# Altium project UNG8266_A.PrjPcb (part 5 of 5)

## Sheet Page 08-Strap&LEDs.SchDoc
size 416 x 264 mm; DrawnBy: Xuelu Li; Engineer: Parthiv/Xuelu; DocumentNumber: 8; Revision: A0; SheetNumber: 8; SheetTotal: 8; PageSetup: Record=PageOptions|CenterHorizontal=True|CenterVertical=True|PrintScale=1.02|XCorrection=1.00|YCorrection=1.00|PrintKind=0|BorderSize=5000000|LeftOffset=0|BottomOffset=0|Orientation=2|PaperLength=1000|PaperWidth=1000|Scale=100|PaperSource=15|PrintQuality=600|MediaType=1|DitherType=10|PrintScaleMode=1|PaperKind=11x17|PaperIndex=17; PageTitle: LEDs & Strapping; ProjName: EVB-LAN9254-DIGIO; DesignDescription: LAN9254 Evaluation Board; Designer: Xuelu Li; PartNumber: EVB-LAN9254-DIGIO; Sheet1Title: LEDs & Strapping; DocumentFullPathAndName: //depot_np_hweng_boards/ung_hweng/UNG_8017_EVB-USB5926/; ProjectName: UNG8266_A.PrjPcb
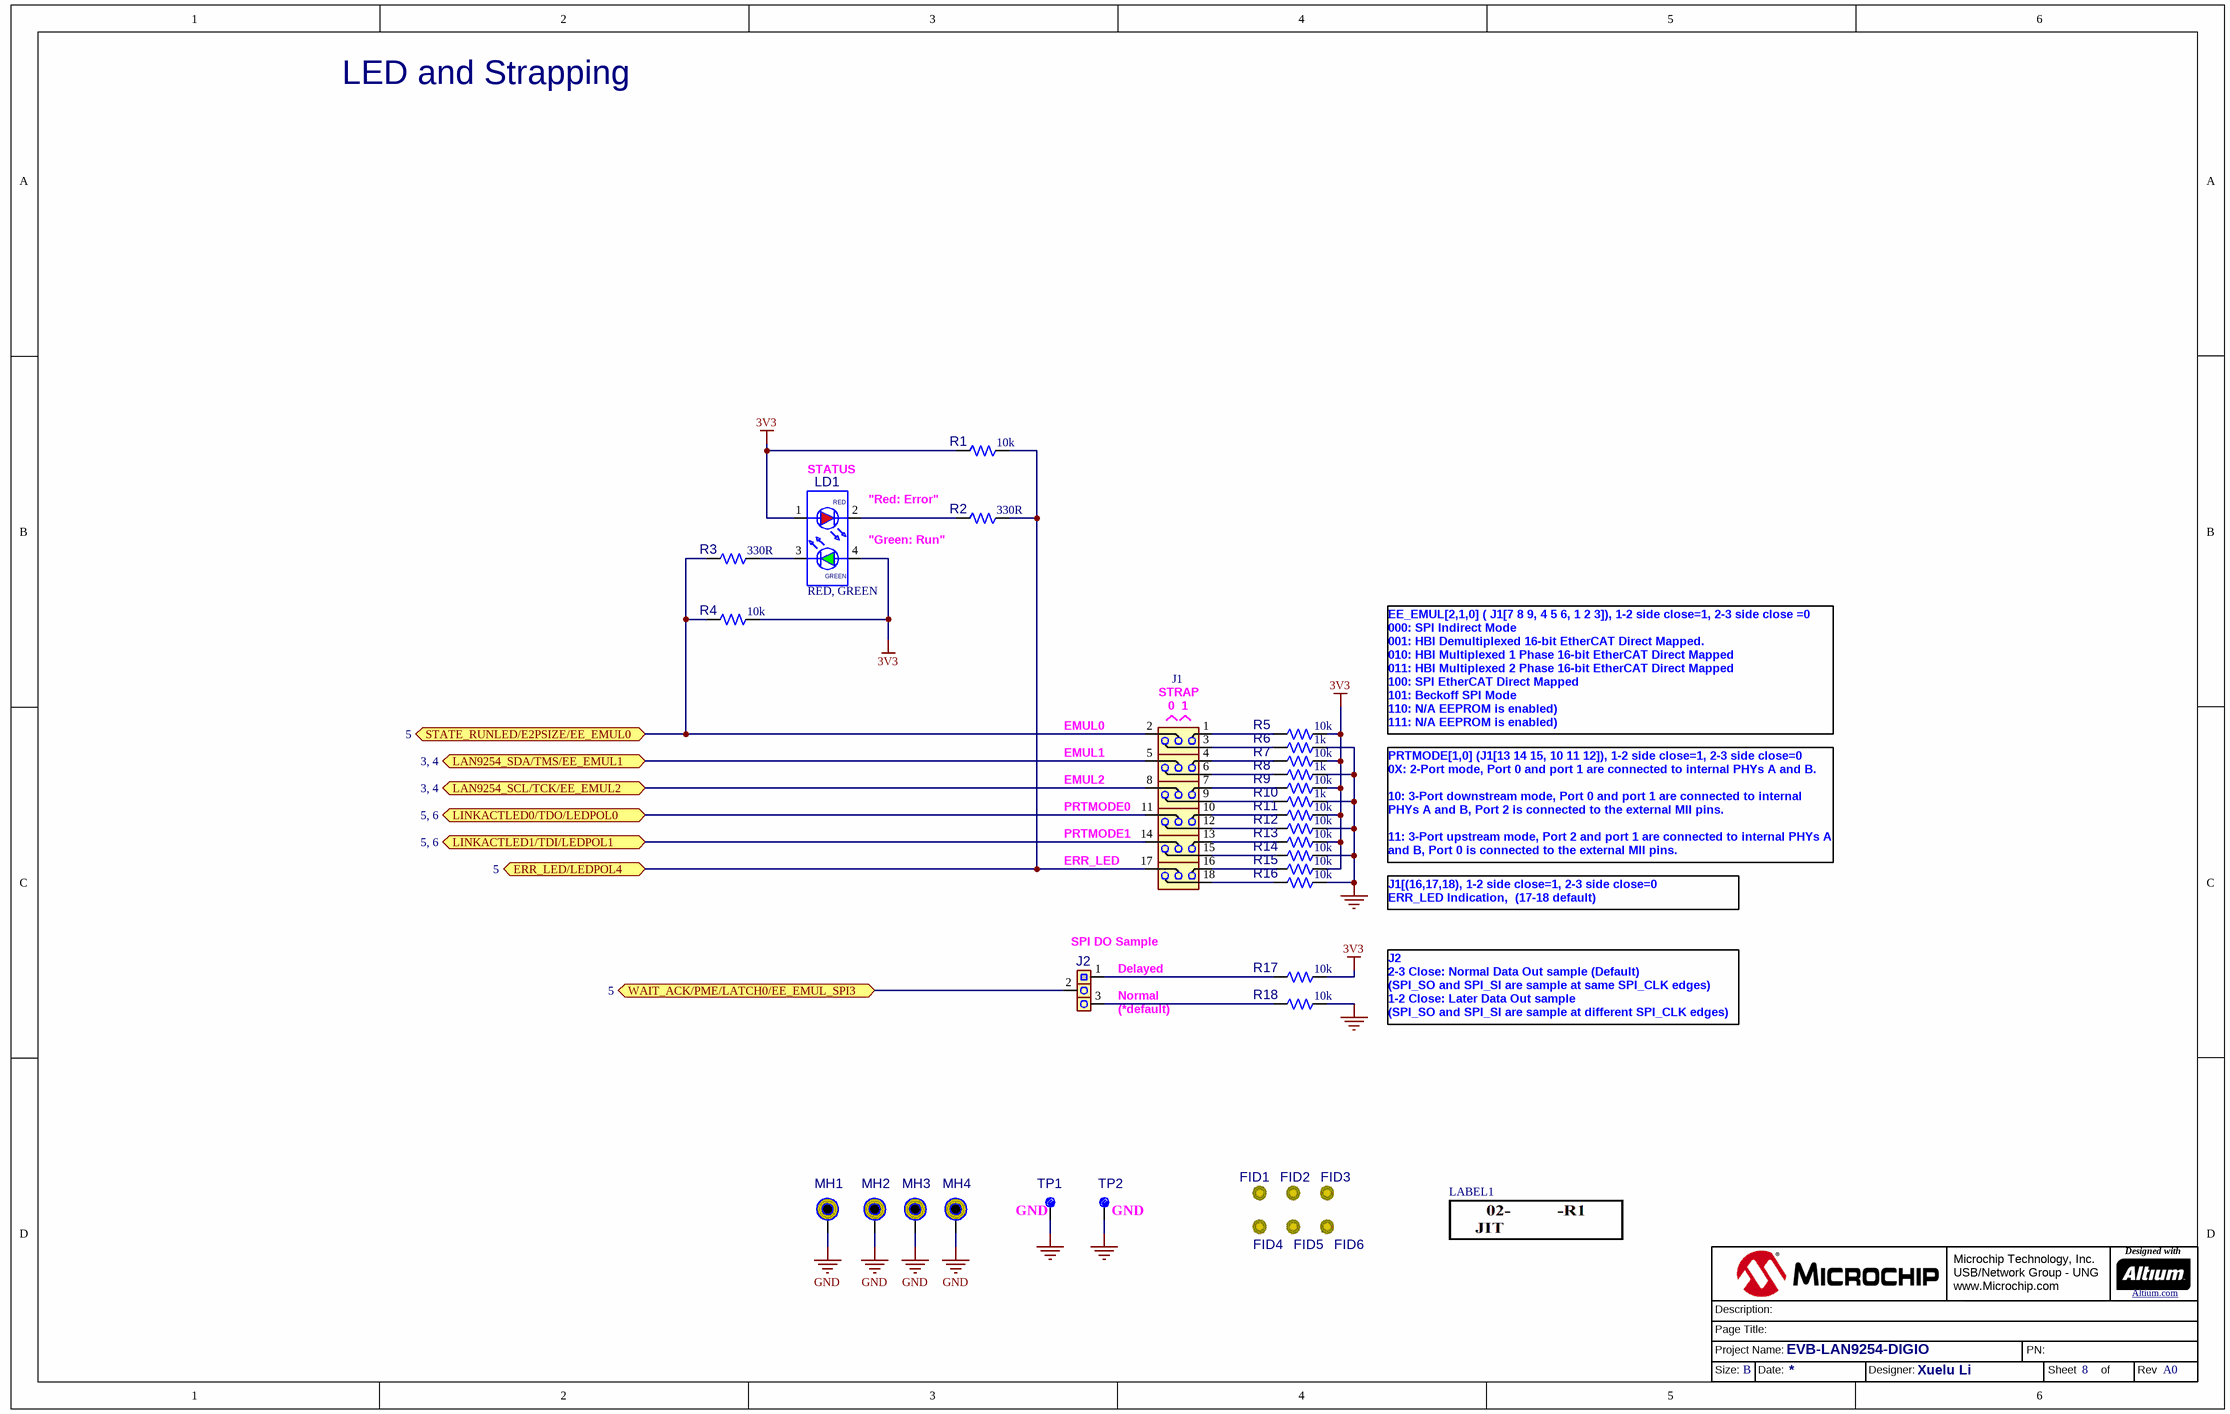
[diagram p7: Page 08-Strap&LEDs.SchDoc]

### Parts
(Parts that share a designator on the sheet are numbered #1, #2 ... from top to bottom, then left to right.)
?#8  (no value)  (graphical)
FID1  FIDUCIAL  [FIDUCIAL]  (value not drawn)  (no BOM)
FID2  FIDUCIAL  [FIDUCIAL]  (value not drawn)  (no BOM)
FID3  FIDUCIAL  [FIDUCIAL]  (value not drawn)  (no BOM)
FID4  FIDUCIAL  [FIDUCIAL]  (value not drawn)  (no BOM)
FID5  FIDUCIAL  [FIDUCIAL]  (value not drawn)  (no BOM)
FID6  FIDUCIAL  [FIDUCIAL]  (value not drawn)  (no BOM)
J1  Header 3X6  [HDR_M_2.54_3X6]  (value not drawn)
J2  Header 1x3  [HDR_M_2.54_1x3]  (value not drawn)
LABEL1  LABEL_Need_Help_Small  [LABEL_Need_Help_Small]  (value not drawn)
LD1  value RED, GREEN  [LED_DUAL_SMD_2x1.25mm]  (hidden comment: LED DUAL 4 pin)
MH1  MTHOLE 4-40 120DL 220PAD  [MTHOLE_4-40]  (value not drawn)  (no BOM)
MH2  MTHOLE 4-40 120DL 220PAD  [MTHOLE_4-40]  (value not drawn)  (no BOM)
MH3  MTHOLE 4-40 120DL 220PAD  [MTHOLE_4-40]  (value not drawn)  (no BOM)
MH4  MTHOLE 4-40 120DL 220PAD  [MTHOLE_4-40]  (value not drawn)  (no BOM)
R1  value 10k  [RES_C_0603]  (hidden comment: Resistor)
R2  value 330R  [RES_C_0603]  (hidden comment: Resistor)
R3  value 330R  [RES_C_0603]  (hidden comment: Resistor)
R4  value 10k  [RES_C_0603]  (hidden comment: Resistor)
R5  value 10k  [RES_C_0603]  (hidden comment: Resistor)
R6  value 1k  [RES_C_0603]  (hidden comment: Resistor)
R7  value 10k  [RES_C_0603]  (hidden comment: Resistor)
R8  value 1k  [RES_C_0603]  (hidden comment: Resistor)
R9  value 10k  [RES_C_0603]  (hidden comment: Resistor)
R10  value 1k  [RES_C_0603]  (hidden comment: Resistor)
R11  value 10k  [RES_C_0603]  (hidden comment: Resistor)
R12  value 10k  [RES_C_0603]  (hidden comment: Resistor)
R13  value 10k  [RES_C_0603]  (hidden comment: Resistor)
R14  value 10k  [RES_C_0603]  (hidden comment: Resistor)
R15  value 10k  [RES_C_0603]  (hidden comment: Resistor)
R16  value 10k  [RES_C_0603]  (hidden comment: Resistor)
R17  value 10k  [RES_C_0603]  (hidden comment: Resistor)
R18  value 10k  [RES_C_0603]  (hidden comment: Resistor)
TP1  Test Point  [CON_TP_TH_V_BLK_KEC_5001]  (value not drawn)
TP2  Test Point  [CON_TP_TH_V_BLK_KEC_5001]  (value not drawn)

### Ports
ERR_LED/LEDPOL4 (bidir, see 5), LAN9254_SCL/TCK/EE_EMUL2 (bidir, see 3, 4), LAN9254_SDA/TMS/EE_EMUL1 (bidir, see 3, 4), LINKACTLED0/TDO/LEDPOL0 (bidir, see 5, 6), LINKACTLED1/TDI/LEDPOL1 (bidir, see 5, 6), STATE_RUNLED/E2PSIZE/EE_EMUL0 (bidir, see 5), WAIT_ACK/PME/LATCH0/EE_EMUL_SPI3 (bidir, see 5)

### Nets
3V3: LD1.1(A1) LD1.4(A2) R1.1 R4.2 R5.1 R7.1 R9.1 R11.1 R13.1 R15.1 R17.1
GND: MH1.1 MH2.1 MH3.1 MH4.1 R6.2 R8.2 R10.2 R12.1 R14.1 R16.1 R18.1 TP1.1 TP2.1
ERR_LED/LEDPOL4: J1.17 R1.2 R2.2 ; port ERR_LED/LEDPOL4
LAN9254_SCL/TCK/EE_EMUL2: J1.8 ; port LAN9254_SCL/TCK/EE_EMUL2
LAN9254_SDA/TMS/EE_EMUL1: J1.5 ; port LAN9254_SDA/TMS/EE_EMUL1
LINKACTLED0/TDO/LEDPOL0: J1.11 ; port LINKACTLED0/TDO/LEDPOL0
LINKACTLED1/TDI/LEDPOL1: J1.14 ; port LINKACTLED1/TDI/LEDPOL1
STATE_RUNLED/E2PSIZE/EE_EMUL0: J1.2 R3.1 R4.1 ; port STATE_RUNLED/E2PSIZE/EE_EMUL0
WAIT_ACK/PME/LATCH0/EE_EMUL_SPI3: J2.2 ; port WAIT_ACK/PME/LATCH0/EE_EMUL_SPI3
NetJ1_1: J1.1 R5.2
NetJ1_3: J1.3 R6.1
NetJ1_4: J1.4 R7.2
NetJ1_6: J1.6 R8.1
NetJ1_7: J1.7 R9.2
NetJ1_9: J1.9 R10.1
NetJ1_10: J1.10 R11.2
NetJ1_12: J1.12 R12.2
NetJ1_13: J1.13 R13.2
NetJ1_15: J1.15 R14.2
NetJ1_16: J1.16 R15.2
NetJ1_18: J1.18 R16.2
NetJ2_1: J2.1 R17.2
NetJ2_3: J2.3 R18.2
NetLD1_2: LD1.2(K1) R2.1
NetLD1_3: LD1.3(K2) R3.2

### Notes on the sheet
- LED and Strapping
- (near LD1) STATUS
- "Red: Error"
- "Green: Run"
- EMUL0
- EMUL1
- (near J1) STRAP
- (near J1) 0
- (near J1) 1
- EE_EMUL[2,1,0] ( J1[7 8 9, 4 5 6, 1 2 3]), 1-2 side close=1, 2-3 side close =0
  000: SPI Indirect Mode
  001: HBI Demultiplexed 16-bit EtherCAT Direct Mapped.
  010: HBI Multiplexed 1 Phase 16-bit EtherCAT Direct Mapped
  011: HBI Multiplexed 2 Phase 16-bit EtherCAT Direct Mapped
  100: SPI EtherCAT Direct Mapped
  101: Beckoff SPI Mode
  110: N/A EEPROM is enabled)
  111: N/A EEPROM is enabled)
- EMUL2
- (near J1) PRTMODE0
- (near J1) ERR_LED
- (near J1) PRTMODE1
- PRTMODE[1,0] (J1[13 14 15, 10 11 12]), 1-2 side close=1, 2-3 side close=0
  0X: 2-Port mode, Port 0 and port 1 are connected to internal PHYs A and B.
  10: 3-Port downstream mode, Port 0 and port 1 are connected to internal PHYs A and B, Port 2 is connected to the external MII pins.
  11: 3-Port upstream mode, Port 2 and port 1 are connected to internal PHYs A and B, Port 0 is connected to the external MII pins.
- (near J2) SPI DO Sample
- J1[(16,17,18), 1-2 side close=1, 2-3 side close=0
  ERR_LED Indication,  (17-18 default)
- (near J2) Delayed
- (near J2) Normal
- (near J2) (*default)
- J2
  2-3 Close: Normal Data Out sample (Default)
  (SPI_SO and SPI_SI are sample at same SPI_CLK edges)
  1-2 Close: Later Data Out sample
  (SPI_SO and SPI_SI are sample at different SPI_CLK edges)
- (near TP1) GND
- (near TP2) GND
- Microchip Technology, Inc.
  USB/Network Group - UNG
  www.Microchip.com
- Designed with
- Altium.com <http://go.altium.com/MicrochipLandingPage_Evaluation.html>
- Page Title:
- Project Name:
- Description:
- PN:
- Size:
- B
- Date:
- Designer:
- Sheet
- of
- Rev
- (in symbol DIODE1110) RED; GREEN

### Library data of the parts
?#8 = Title Block B_UNG1_Altium
FID1-FID6 = FIDUCIAL: Populated: DNP; Revision: 0; Description_: FIDUCIAL
J1 = MIC8078: Manufacturer 1: Digikey; Manufacturer Part Number 1: TSW-106-07-G-T; Value: HDR_M_2.54_3X6; Dev Tools Status: Design; Owner: Manikandan Balakrishnan; Populated: YES; MCHP-ID: MIC8078; Revision: A; Symbol: header 3x6; Description_: Header 3X6; Status: MCL Design; ComponentLink1URL: https://chn-vm-apps.microchip.com/mchprepo/parts/Datasheets/tsw-xxx-xx-xxx-x-xx-xxx-mkt; ComponentLink1Description: SVN Datasheet; ComponentLink2URL: C:\ALTIUM_WORK\00001_MCHP-CDB\Datasheets\tsw-xxx-xx-xxx-x-xx-xxx-mkt; ComponentLink2Description: Local Datasheet; ComponentLink3URL: C:\ALTIUM_WORK\00001_MCHP-CDB\Library\LibraryRefs\header 3x6.SchLib; ComponentLink3Description: Open Symbol; ComponentLink4URL: C:\ALTIUM_WORK\00001_MCHP-CDB\Library\Footprints\HDR_M_2.54_3X6.PcbLib; ComponentLink4Description: Open Footprint; ComponentLink5Description: Open Footprint 2; ComponentLink6Description: Open Footprint 3; ComponentLink7Description: Open Footprint 4; Type: Header 2.54mm; Category: Connector; Supplier 1: Digikey; Supplier Part Number 1: TSW-106-07-G-T-ND; Quantity Override: 1
J2 = CON0465: Manufacturer 1: Samtec; Manufacturer Part Number 1: TSW-103-07-T-S; Value: HDR-2.54 Male 1x3; Description_: CON HDR-2.54 Male 1x3 Tin 5.84MH TH VERT; Dev Tools Status: Production; Populated: Yes; MCHP-ID: CON0465; Revision: 1; Symbol: Header 1x3; Status: MCL Design; ComponentLink1URL: https://chn-vm-apps.microchip.com/mchprepo/parts/Datasheets/TSW-XXX-XX-XXX-X-XX-XXX-MKT.pdf; ComponentLink1Description: SVN Datasheet; ComponentLink2URL: C:\ALTIUM_WORK\00001_MCHP-CDB\Datasheets\TSW-XXX-XX-XXX-X-XX-XXX-MKT.pdf; ComponentLink2Description: Local Datasheet; ComponentLink3URL: C:\ALTIUM_WORK\00001_MCHP-CDB\Library\LibraryRefs\Header 1x3.SchLib; ComponentLink3Description: Open Symbol; ComponentLink4URL: C:\ALTIUM_WORK\00001_MCHP-CDB\Library\Footprints\HDR_M_2.54_1x3.PcbLib; ComponentLink4Description: Open Footprint; ComponentLink5Description: Open Footprint 2; ComponentLink6Description: Open Footprint 3; ComponentLink7Description: Open Footprint 4; Type: Header 2.54mm; Category: Connector; Manufacturer 2: SHENZHEN JUNHAO ENGINEERING; Manufacturer Part Number 2: R-211-0311-0021-000; Supplier 1: Digi-Key; Supplier Part Number 1: SAM1035-03-ND; Supplier 2: Raynen; Supplier Part Number 2: CONN00253B01; Quantity Override: 1
LABEL1 = 08-00028: Value: LABEL Need Help Small; Description_: LABEL, ASSY W/REV LEVEL (SMALL MODULES) PER MTS-0002; Dev Tools Status: Production; Populated: MECH; MCHP-ID: 08-00028; Revision: 6; Symbol: LABEL_Need_Help_Small; Status: MCL Design; ComponentLink1URL: https://chn-vm-apps.microchip.com/mchprepo/parts/Datasheets/08-00028R6.pdf; ComponentLink1Description: SVN Datasheet; ComponentLink2URL: C:\ALTIUM_WORK\00001_MCHP-CDB\Datasheets\08-00028R6.pdf; ComponentLink2Description: Local Datasheet; ComponentLink3URL: C:\ALTIUM_WORK\00001_MCHP-CDB\Library\LibraryRefs\LABEL_Need_Help_Small.SchLib; ComponentLink3Description: Open Symbol; ComponentLink4URL: C:\ALTIUM_WORK\00001_MCHP-CDB\Library\Footprints\LABEL_Need_Help_Small.PcbLib; ComponentLink4Description: Open Footprint; ComponentLink5Description: Open Footprint 2; ComponentLink6Description: Open Footprint 3; ComponentLink7Description: Open Footprint 4; Type: Small; Category: Label; Quantity Override: 1
LD1 = DIODE1110: LED; Manufacturer 1: Kingbright Corp; Manufacturer Part Number 1: APHBM2012SURKCGKC; Description_: DIO LED BI RED, GREEN 1.95V, 2.1V 30mA 0805; Dev Tools Status: Production; Type: LED Bicolor; Forward Current: 30mA; Power: 75mW; Reverse Current: 10uA; Owner: Bogdan P (M91398); Populated: Yes; MCHP-ID: DIODE1110; Revision: 0; Symbol: LED DUAL 4 PIN; Status: MCL Design; Package: 0805; ComponentLink1URL: https://chn-vm-apps.microchip.com/mchprepo/parts/Datasheets/APHBM2012SURKCGKC.pdf; ComponentLink1Description: SVN Datasheet; ComponentLink2URL: C:\ALTIUM_WORK\00001_MCHP-CDB\Datasheets\APHBM2012SURKCGKC.pdf; ComponentLink2Description: Local Datasheet; ComponentLink3URL: C:\ALTIUM_WORK\00001_MCHP-CDB\Library\LibraryRefs\LED DUAL 4 PIN.SchLib; ComponentLink3Description: Open Symbol; ComponentLink4URL: C:\ALTIUM_WORK\00001_MCHP-CDB\Library\Footprints\LED_DUAL_SMD_2x1.25mm.PcbLib; ComponentLink4Description: Open Footprint; ComponentLink5Description: Open Footprint 2; ComponentLink6Description: Open Footprint 3; ComponentLink7Description: Open Footprint 4; Operating Temperature: -40C to +85C; Category: Diode; Supplier 1: Digi-Key; Supplier Part Number 1: 754-1093-1-ND; Quantity Override: 1
MH1-MH4 = MTHOLE 4-40 120DL 220PAD: Populated: DNP; Revision: 0; Description_: MTHOLE 4-40 120DL 220PAD
R1 R4 R5 R7 R9 R11-R18 = RSMT0139: Manufacturer 1: Panasonic; Manufacturer Part Number 1: ERJ-3EKF1002V; Tolerance: 1%; Description_: RES TKF 10k 1% 1/10W SMD 0603; Dev Tools Status: Production; Temperature Coeffcient: 100ppm/C; Power: 1/10W; Populated: Yes; MCHP-ID: RSMT0139; Package: 0603; Revision: 2; Symbol: Resistor; Status: MCL Design; ComponentLink1URL: https://chn-vm-apps.microchip.com/mchprepo/parts/Datasheets/nrc.pdf; ComponentLink1Description: SVN Datasheet; ComponentLink2URL: C:\ALTIUM_WORK\00001_MCHP-CDB\Datasheets\nrc.pdf; ComponentLink2Description: Local Datasheet; ComponentLink3URL: C:\ALTIUM_WORK\00001_MCHP-CDB\Library\LibraryRefs\Resistor.SchLib; ComponentLink3Description: Open Symbol; ComponentLink4URL: C:\ALTIUM_WORK\00001_MCHP-CDB\Library\Footprints\RES_C_0603.PcbLib; ComponentLink4Description: Open Footprint; ComponentLink5Description: Open Footprint 2; ComponentLink6Description: Open Footprint 3; ComponentLink7Description: Open Footprint 4; Operating Temperature: -55C to +155C; Category: Resistor; Type: RES SMD; Composition: TKF; Manufacturer 2: Stackpole Electronics Inc; Manufacturer Part Number 2: RMCF0603FT10K0; Manufacturer 3: Yageo; Manufacturer Part Number 3: RC0603FR-0710KL; Manufacturer 4: Stackpole Electronics Inc; Manufacturer Part Number 4: RMCF 1/16 10K 1% R; Manufacturer 5: Xicon; Manufacturer Part Number 5: 302-10K-RC; Manufacturer 6: NIC Components; Manufacturer Part Number 6: NRC06F1002TRF; Supplier 1: Digi-Key; Supplier Part Number 1: P10.0KHCT-ND; Supplier 2: Digi-Key; Supplier Part Number 2: RMCF1/1610KFRTR-ND; Supplier 3: Digi-Key; Supplier Part Number 3: 311-10.0KHRCT-ND; Supplier 4: Digi-Key; Supplier Part Number 4: RMCF0603FT10K0TR-ND; Supplier 5: Mouser; Supplier Part Number 5: 302-10k-RC; Supplier 6: NIC Components; Supplier Part Number 6: NRC06F1002TRF; Quantity Override: 1
R2 R3 = RES0195: Manufacturer 1: ROHM; Manufacturer Part Number 1: MCR03EZPJ331; Tolerance: 5%; Description_: RES TKF 330R 5% 1/10W SMD 0603; Dev Tools Status: Production; Voltage: 50V; Temperature Coeffcient: 100ppm/C; Power: 1/10W; Populated: Yes; MCHP-ID: RES0195; Package: 0603; Revision: 1; Symbol: Resistor; Status: MCL Design; ComponentLink1URL: https://chn-vm-apps.microchip.com/mchprepo/parts/Datasheets/mcr_a.pdf; ComponentLink1Description: SVN Datasheet; ComponentLink2URL: C:\ALTIUM_WORK\00001_MCHP-CDB\Datasheets\mcr_a.pdf; ComponentLink2Description: Local Datasheet; ComponentLink3URL: C:\ALTIUM_WORK\00001_MCHP-CDB\Library\LibraryRefs\Resistor.SchLib; ComponentLink3Description: Open Symbol; ComponentLink4URL: C:\ALTIUM_WORK\00001_MCHP-CDB\Library\Footprints\RES_C_0603.PcbLib; ComponentLink4Description: Open Footprint; ComponentLink5Description: Open Footprint 2; ComponentLink6Description: Open Footprint 3; ComponentLink7Description: Open Footprint 4; Operating Temperature: -55C to +155C; Category: Resistor; Type: RES SMD; Composition: TKF; Manufacturer 2: Stackpole Electronics Inc; Manufacturer Part Number 2: RMCF0603JT330R; Manufacturer 3: Yageo; Manufacturer Part Number 3: 9C06031A3300JLHFT; Supplier 1: Digi-Key; Supplier Part Number 1: RHM330GCT-ND; Supplier 2: Digi-Key; Supplier Part Number 2: RMCF0603JT330RCT-ND; Supplier 3: Digi-Key; Supplier Part Number 3: 311-330GDKR-ND; Quantity Override: 1
R6 R8 R10 = RES1128: Manufacturer 1: Panasonic; Manufacturer Part Number 1: ERJ-3GEYJ102V; Tolerance: 5%; Description_: RES TKF 1k 5% 1/10W SMD 0603; Dev Tools Status: Production; Voltage: 75V; Temperature Coeffcient: 200ppm/C; Power: 1/10W; Owner: Bogdan P (M91398); Populated: Yes; MCHP-ID: RES1128; Package: 0603; Revision: 0; Symbol: Resistor; Status: MCL Design; ComponentLink1URL: https://chn-vm-apps.microchip.com/mchprepo/parts/Datasheets/AOA0000CE1.pdf; ComponentLink1Description: SVN Datasheet; ComponentLink2URL: C:\ALTIUM_WORK\00001_MCHP-CDB\Datasheets\AOA0000CE1.pdf; ComponentLink2Description: Local Datasheet; ComponentLink3URL: C:\ALTIUM_WORK\00001_MCHP-CDB\Library\LibraryRefs\Resistor.SchLib; ComponentLink3Description: Open Symbol; ComponentLink4URL: C:\ALTIUM_WORK\00001_MCHP-CDB\Library\Footprints\RES_C_0603.PcbLib; ComponentLink4Description: Open Footprint; ComponentLink5Description: Open Footprint 2; ComponentLink6Description: Open Footprint 3; ComponentLink7Description: Open Footprint 4; Operating Temperature: -55C to +155C; Category: Resistor; Type: RES SMD; Composition: TKF; Supplier 1: Digi-Key; Supplier Part Number 1: P1.0KGCT-ND; Quantity Override: 1
TP1 TP2 = MISC0026: Manufacturer 1: Keystone; Manufacturer Part Number 1: 5001; Value: TP LOOP Black; Description_: MISC, TEST POINT MULTI PURPOSE MINI BLACK; Dev Tools Status: Production; Owner: Stephen Humberd; Populated: YES; MCHP-ID: MISC0026; Revision: 0; Symbol: Test Point; Status: MCL Design; ComponentLink1URL: https://chn-vm-apps.microchip.com/mchprepo/parts/Datasheets/5000-5004.PDF; ComponentLink1Description: SVN Datasheet; ComponentLink2URL: C:\ALTIUM_WORK\00001_MCHP-CDB\Datasheets\5000-5004.PDF; ComponentLink2Description: Local Datasheet; ComponentLink3URL: C:\ALTIUM_WORK\00001_MCHP-CDB\Library\LibraryRefs\Test Point.SchLib; ComponentLink3Description: Open Symbol; ComponentLink4URL: C:\ALTIUM_WORK\00001_MCHP-CDB\Library\Footprints\CON_TP_TH_V_BLK_KEC_5001.PcbLib; ComponentLink4Description: Open Footprint; ComponentLink5Description: Open Footprint 2; ComponentLink6Description: Open Footprint 3; ComponentLink7Description: Open Footprint 4; Type: Test Point; Category: Connector; Supplier 1: Digi-Key; Supplier Part Number 1: 36-5001-ND; Quantity Override: 1

## Nets that join several sheets
3V3: PAGE 03-Power&I2C (27 pins), Page 04-LAN9254-Part1 (25 pins), Page 05-LAN9254-Part2 (5 pins), PAGE 06-Copper Ports (R110.1 R117.1), PAGE 07-DIGITAL IO (32 pins), Page 08-Strap&LEDs (11 pins)
5-12V: PAGE 03-Power&I2C (6 pins), Page 05-LAN9254-Part2 (J8.3)
GND: PAGE 03-Power&I2C (30 pins), Page 04-LAN9254-Part1 (44 pins), Page 05-LAN9254-Part2 (32 pins), PAGE 06-Copper Ports (14 pins), PAGE 07-DIGITAL IO (36 pins), Page 08-Strap&LEDs (13 pins)
VDD33TXRX1: Page 04-LAN9254-Part1 (C8.1 C9.2 FB2.2 U4.67), PAGE 06-Copper Ports (5 pins)
VDD33TXRX2: Page 04-LAN9254-Part1 (C23.2 C24.1 FB4.2 U4.80), PAGE 06-Copper Ports (5 pins)
DIGIO0: Page 05-LAN9254-Part2 (R61.1 R72.1 U4.49 U5.2), PAGE 07-DIGITAL IO (J22.2)
DIGIO1: Page 05-LAN9254-Part2 (R68.1 R73.1 U4.52 U5.3), PAGE 07-DIGITAL IO (J22.5)
DIGIO2: Page 05-LAN9254-Part2 (R70.1 R74.1 U4.53 U5.4), PAGE 07-DIGITAL IO (J22.8)
DIGIO3: Page 05-LAN9254-Part2 (R75.1 U4.62 U5.5), PAGE 07-DIGITAL IO (J22.11)
DIGIO4: Page 05-LAN9254-Part2 (R59.1 R76.1 U4.30 U5.6), PAGE 07-DIGITAL IO (J22.14)
DIGIO5: Page 05-LAN9254-Part2 (R58.1 R77.1 U4.29 U5.7), PAGE 07-DIGITAL IO (J22.17)
DIGIO6: Page 05-LAN9254-Part2 (R55.1 R78.1 U4.28 U5.8), PAGE 07-DIGITAL IO (J22.20)
DIGIO7: Page 05-LAN9254-Part2 (R54.1 R79.1 U4.20 U5.9), PAGE 07-DIGITAL IO (J22.23)
DIGIO8: Page 05-LAN9254-Part2 (R53.1 R80.1 U4.19 U6.2), PAGE 07-DIGITAL IO (J23.2)
DIGIO9: Page 05-LAN9254-Part2 (R60.1 R81.1 U4.41 U6.3), PAGE 07-DIGITAL IO (J23.5)
DIGIO10: Page 05-LAN9254-Part2 (R82.1 U4.36 U6.4), PAGE 07-DIGITAL IO (J23.8)
DIGIO11: Page 05-LAN9254-Part2 (R62.1 R83.1 U4.33 U6.5), PAGE 07-DIGITAL IO (J23.11)
DIGIO12: Page 05-LAN9254-Part2 (R63.1 R84.1 U4.34 U6.6), PAGE 07-DIGITAL IO (J23.14)
DIGIO13: Page 05-LAN9254-Part2 (R65.1 R85.1 U4.35 U6.7), PAGE 07-DIGITAL IO (J23.17)
DIGIO14: Page 05-LAN9254-Part2 (R66.1 R86.1 U4.37 U6.8), PAGE 07-DIGITAL IO (J23.20)
DIGIO15: Page 05-LAN9254-Part2 (R67.1 R87.1 U4.38 U6.9), PAGE 07-DIGITAL IO (J23.23)
DIGIO16: Page 05-LAN9254-Part2 (R88.1 U4.12 U7.2), PAGE 07-DIGITAL IO (J24.2)
DIGIO17: Page 05-LAN9254-Part2 (R89.1 U4.13 U7.3), PAGE 07-DIGITAL IO (J24.5)
DIGIO18: Page 05-LAN9254-Part2 (R90.1 U4.17 U7.4), PAGE 07-DIGITAL IO (J24.8)
DIGIO19: Page 05-LAN9254-Part2 (R91.1 U4.18 U7.5), PAGE 07-DIGITAL IO (J24.11)
DIGIO20: Page 05-LAN9254-Part2 (R92.1 U4.23 U7.6), PAGE 07-DIGITAL IO (J24.14)
DIGIO21: Page 05-LAN9254-Part2 (R93.1 U4.24 U7.7), PAGE 07-DIGITAL IO (J24.17)
DIGIO22: Page 05-LAN9254-Part2 (R94.1 U4.25 U7.8), PAGE 07-DIGITAL IO (J24.20)
DIGIO23: Page 05-LAN9254-Part2 (R95.1 U4.40 U7.9), PAGE 07-DIGITAL IO (J24.23)
DIGIO24: Page 05-LAN9254-Part2 (R96.1 U4.42 U8.2), PAGE 07-DIGITAL IO (J25.2)
DIGIO25: Page 05-LAN9254-Part2 (R97.1 U4.44 U8.3), PAGE 07-DIGITAL IO (J25.5)
DIGIO26: Page 05-LAN9254-Part2 (R98.1 U4.45 U8.4), PAGE 07-DIGITAL IO (J25.8)
DIGIO27: Page 05-LAN9254-Part2 (R99.1 U4.46 U8.5), PAGE 07-DIGITAL IO (J25.11)
DIGIO28: Page 05-LAN9254-Part2 (R100.1 U4.47 U8.6), PAGE 07-DIGITAL IO (J25.14)
DIGIO29: Page 05-LAN9254-Part2 (R101.1 U4.64 U8.7), PAGE 07-DIGITAL IO (J25.17)
DIGIO30: Page 05-LAN9254-Part2 (R102.1 U4.65 U8.8), PAGE 07-DIGITAL IO (J25.20)
DIGIO31: Page 05-LAN9254-Part2 (R103.1 U4.66 U8.9), PAGE 07-DIGITAL IO (J25.23)
EOF: PAGE 03-Power&I2C (J4.5 R25.1), Page 05-LAN9254-Part2 (U4.15)
ERR_LED/LEDPOL4: Page 05-LAN9254-Part2 (U4.9), Page 08-Strap&LEDs (J1.17 R1.2 R2.2)
LAN9254_SCL/TCK/EE_EMUL2: PAGE 03-Power&I2C (R35.1 U2.6), Page 04-LAN9254-Part1 (U4.56), Page 08-Strap&LEDs (J1.8)
LAN9254_SDA/TMS/EE_EMUL1: PAGE 03-Power&I2C (R34.1 U2.5), Page 04-LAN9254-Part1 (U4.55), Page 08-Strap&LEDs (J1.5)
LATCH0: PAGE 03-Power&I2C (J4.9 R27.1), Page 05-LAN9254-Part2 (R71.2 U4.43)
LATCH1: PAGE 03-Power&I2C (J4.11 R28.1), Page 05-LAN9254-Part2 (R57.2 U4.22)
LATCH_IN: PAGE 03-Power&I2C (6 pins), Page 05-LAN9254-Part2 (U4.26)
LINKACTLED0/TDO/LEDPOL0: Page 05-LAN9254-Part2 (U4.61), PAGE 06-Copper Ports (J20.10), Page 08-Strap&LEDs (J1.11)
LINKACTLED1/TDI/LEDPOL1: Page 05-LAN9254-Part2 (U4.59), PAGE 06-Copper Ports (J21.10), Page 08-Strap&LEDs (J1.14)
OE_EXT: PAGE 03-Power&I2C (J4.15 R30.1), Page 05-LAN9254-Part2 (R64.1 U4.32)
OUTVALID: PAGE 03-Power&I2C (J4.17 R31.2), Page 05-LAN9254-Part2 (5 pins)
RXA_N: Page 04-LAN9254-Part1 (U4.70), PAGE 06-Copper Ports (C43.2 J20.6 R108.1)
RXA_P: Page 04-LAN9254-Part1 (U4.71), PAGE 06-Copper Ports (C42.2 J20.3 R107.1)
RXB_N: Page 04-LAN9254-Part1 (U4.77), PAGE 06-Copper Ports (C48.2 J21.6 R115.1)
RXB_P: Page 04-LAN9254-Part1 (U4.76), PAGE 06-Copper Ports (C47.2 J21.3 R114.1)
SOF: PAGE 03-Power&I2C (J4.7 R26.1), Page 05-LAN9254-Part2 (U4.14)
STATE_RUNLED/E2PSIZE/EE_EMUL0: Page 05-LAN9254-Part2 (U4.58), Page 08-Strap&LEDs (J1.2 R3.1 R4.1)
TXA_N: Page 04-LAN9254-Part1 (U4.68), PAGE 06-Copper Ports (C41.2 J20.2 R106.1)
TXA_P: Page 04-LAN9254-Part1 (U4.69), PAGE 06-Copper Ports (C40.2 J20.1 R105.1)
TXB_N: Page 04-LAN9254-Part1 (U4.79), PAGE 06-Copper Ports (C46.2 J21.2 R113.1)
TXB_P: Page 04-LAN9254-Part1 (U4.78), PAGE 06-Copper Ports (C45.2 J21.1 R112.1)
WAIT_ACK/PME/LATCH0/EE_EMUL_SPI3: Page 05-LAN9254-Part2 (U4.10), Page 08-Strap&LEDs (J2.2)
WD_STATE: PAGE 03-Power&I2C (J4.3 R24.1 R33.1), Page 05-LAN9254-Part2 (U4.21)
WD_TRIG: PAGE 03-Power&I2C (J4.13 R29.1), Page 05-LAN9254-Part2 (U4.48)